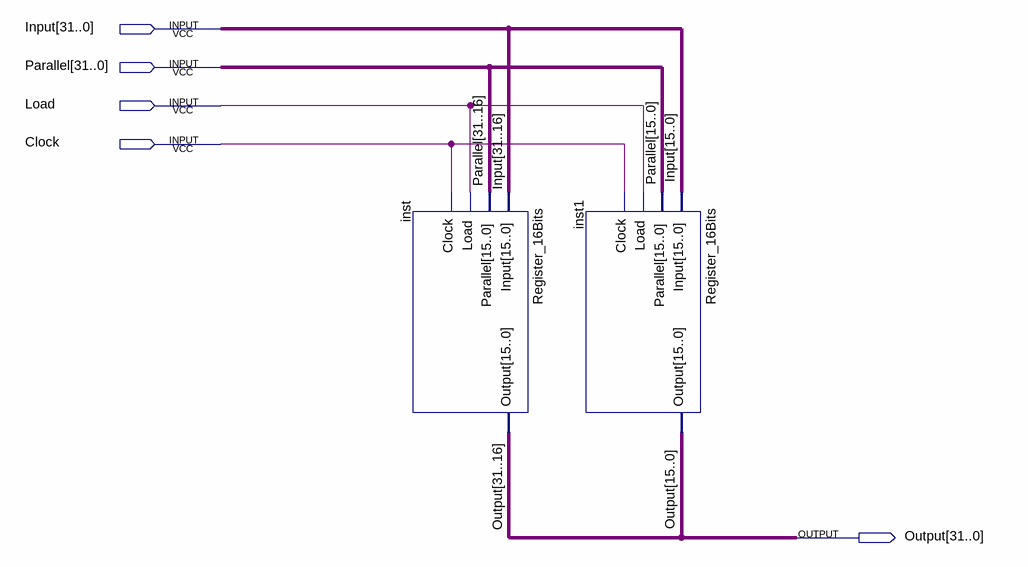
[diagram p0: schematic sheet]
// Quartus schematic Register_32Bits.bdf as structural Verilog: 2 symbols, 5 pins
module Register_32Bits (
  input  [31:0] Input,
  input  [31:0] Parallel,
  input  Load,
  input  Clock,
  output [31:0] Output
);

  Register_16Bits inst (
    .Input(Input[31:16]), .Parallel(Parallel[31:16]), .Load(Load), .Clock(Clock), .Output(Output[31:16]));
  Register_16Bits inst1 (
    .Input(Input[15:0]), .Parallel(Parallel[15:0]), .Load(Load), .Clock(Clock), .Output(Output[15:0]));
endmodule
